# EAGLE design thermocoupleMv1 (EAGLE 6.2)
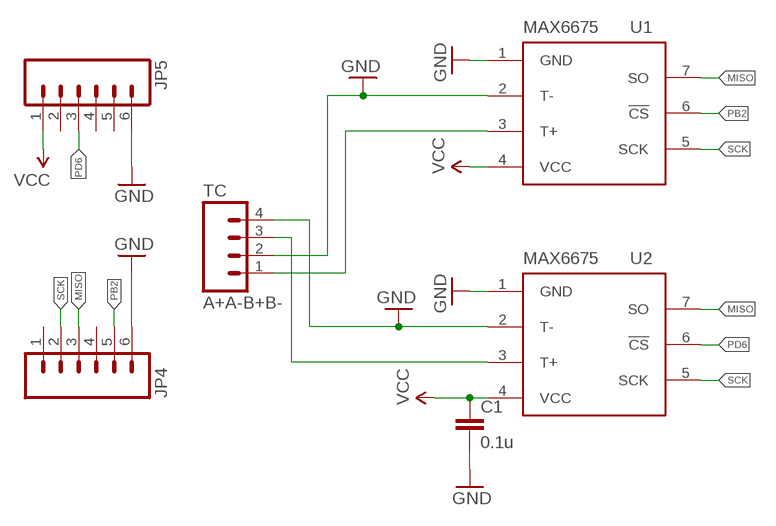
[diagram p0: schematic, sheet 1]

## Parts
C1  0.1u  CAP0805  [0805]
JP4  M06LOCK_LONGPADS  [1X06_LOCK_LONGPADS]
JP5  M06LOCK_LONGPADS  [1X06_LOCK_LONGPADS]
TC  A+A-B+B-  M04LOCK_LONGPADS  [1X04_LOCK_LONGPADS]
U1  MAX6675  [SO08]
U2  MAX6675  [SO08]

## Nets
GND: C1.2 JP4.6 JP5.6 TC.2 TC.4 U1.1(GND) U1.2(T-) U2.1(GND) U2.2(T-)
MISO: JP4.3 U1.7(SO) U2.7(SO)
N$1: TC.1 U1.3(T+)
N$3: TC.3 U2.3(T+)
PB2: JP4.5 U1.6(!CS)
PD6: JP5.3 U2.6(!CS)
SCK: JP4.2 U1.5(SCK) U2.5(SCK)
VCC: C1.1 JP5.1 U1.4(VCC) U2.4(VCC)
Unconnected: JP4.1 JP4.4 JP5.2 JP5.4 JP5.5

## Library data of the parts
C1 = SparkFun-Capacitors:CAP: Capacitor Standard 0603 ceramic capacitor, and 0.1" leaded capacitor.
JP4 JP5 = SparkFun:M06: Header 6 Standard 6-pin 0.1" header. Use with straight break away headers (SKU : PRT-00116), right angle break away headers (PRT-00553), swiss pins (PRT-00743), machine pins (PRT-00117), and female headers (PRT-00115). Molex polarized connector foot print use with SKU : PRT-08094 with associated crimp pins and housings. NOTES ON THE VARIANTS LOCK and LOCK_LONGPADS... This footprint was designed to help hold the alignment of a through-hole component (i.e. 6-pin header) while soldering it into place. You may notice that each hole has been shifted either up or down by 0.005 of an inch from it's more standard position (which is a perfectly straight line). This slight alteration caused the pins (the squares in the middle) to touch the edges of the holes. Because they are alternating, it causes a "brace" to hold the component in place. 0.005 has proven to be the perfect amount of "off-center" position when using our standard breakaway headers. Although looks a little odd when you look at the bare footprint, once you have a header in there, the alteration is very hard to notice. Also, if you push a header all the way into place, it is covered up entirely on the bottom side. This idea of altering the position of holes to aid alignment will be further integrated into the Sparkfun Library for other footprints. It can help hold any component with 3 or more connection pins.
TC = SparkFun:M04: Header 4 Standard 4-pin 0.1" header. Use with straight break away headers (SKU : PRT-00116), right angle break away headers (PRT-00553), swiss pins (PRT-00743), machine pins (PRT-00117), and female headers (PRT-00115). Molex polarized connector foot print use with SKU : PRT-08231 with associated crimp pins and housings.
U1 U2 = exoteric-analytics-custom:MAX6675

## Board
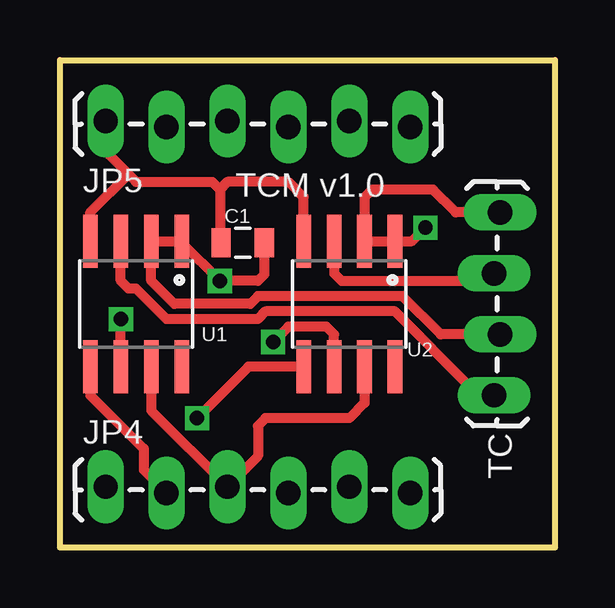
[diagram p1: board, top side]
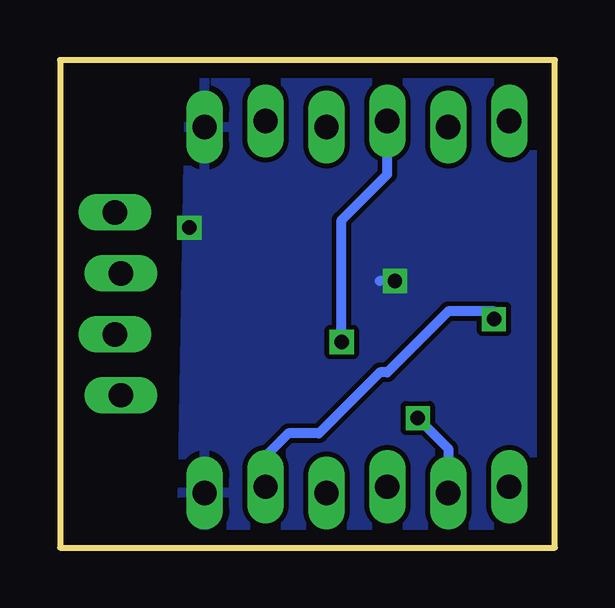
[diagram p2: board, bottom side, seen from below]

Size 20.64 x 20.32 mm. Coordinates in mm from the lower left corner, seen from the top.
Outline: 0,0 0,20.32 20.64,20.32 20.64,0 0,0
Copper layers (1*16): Top 0.035mm / dielectric 1.5mm / Bottom 0.035mm
Design rules: minimum track width 10mil, minimum drill 20mil, track to track 8mil, track to pad 8mil, pad to pad 8mil, via to via 8mil, smd to smd 8mil, copper to edge 24mil, drill to drill 8mil, minimum pad ring 10mil, minimum via ring 8mil, stop-mask expansion 4mil, vias tented up to drill 0mil, thermal gap 10mil

### Footprints (pad centres in the part's own frame; a part is rotated, then mirrored left to right if it is on the bottom)
0805 = smd 0.8 x 1.2: 1 -0.9,0; 2 0.9,0
1X06_LOCK_LONGPADS = drill 1.016 long: 1 0,0; 2 2.54,-0.254; 3 5.08,0; 4 7.62,-0.254; 5 10.16,0; 6 12.7,-0.254
1X04_LOCK_LONGPADS = drill 1.016 long: 1 0,0; 2 2.54,-0.254; 3 5.08,0; 4 7.62,-0.254
SO08 = smd 0.61 x 2.21: 1 -1.905,-2.616; 2 -0.635,-2.616; 3 0.635,-2.616; 4 1.905,-2.616; 5 1.905,2.616; 6 0.635,2.616; 7 -0.635,2.616; 8 -1.905,2.616

### Placement (x,y rotation side)
C1  7.62,12.7 0 top
JP4  1.91,2.54 0 top
JP5  1.91,17.78 0 top
TC  18.1,6.35 90 top
U1  3.17,10.16 180 top
U2  12.06,10.16 180 top

### Tracks (layer width: path | path; a pad name or v marks a point on that pad's centre or on a via)
GND  (via drill 0.6)
  Top 0.406: v15.24,13.34 14.68,12.78 U2.1 U2.2 12.7,14.61 13.02,14.92 15.56,14.92 16.51,13.97 TC.4 | TC.2 15.88,8.89 14.29,10.48 8.26,10.48 7.94,10.16 4.76,10.16 3.81,11.11 U1.2 U1.1 5.08,12.7 v6.67,11.11 8.26,11.11 8.52,11.38 C1.2
  Bottom 0.406: v15.24,13.34 14.92,13.34 | v6.67,11.11 7.3,11.11
  pour Bottom: 0.64,19.68 15.24,19.68 15.56,0.64 0.64,0.64
MISO
  Top 0.406: U1.7 3.81,5.71 JP4.3 8.26,3.81 8.26,5.08 8.57,5.4 12.06,5.4 12.7,6.03 U2.7
N$1
  Top 0.406: TC.1 17.14,6.67 13.97,9.84 8.57,9.84 8.26,9.53 4.45,9.53 3.17,10.79 2.86,10.79 2.54,11.11 U1.3
N$3
  Top 0.406: U2.3 11.43,11.43 11.75,11.11 16.83,11.11 TC.3
PB2  (via drill 0.6)
  Top 0.406: U1.6 v2.54,9.53
  Bottom 0.406: v2.54,9.53 2.54,9.84 4.45,9.84 6.99,7.3 7.3,7.3 9.84,4.76 11.11,4.76 12.06,3.81 JP4.5
PD6  (via drill 0.6)
  Top 0.406: U2.6 11.43,8.89 11.11,9.21 9.53,9.21 v8.89,8.57
  Bottom 0.406: v8.89,8.57 8.89,13.65 6.99,15.56 JP5.3
SCK  (via drill 0.6)
  Top 0.406: U1.5 1.27,6.35 3.49,4.13 3.49,3.24 JP4.2 | U2.5 7.86,7.54 v5.71,5.4
  Bottom 0.406: v5.71,5.4 4.45,4.13 JP4.2
VCC
  Top 0.406: JP5.1 1.91,16.51 2.86,15.56 | 2.86,15.56 3.17,15.24 6.35,15.24 6.67,14.92 | 6.67,14.92 6.67,12.75 C1.1 | U1.4 1.27,13.97 2.86,15.56 | U2.4 10.16,14.61 9.53,15.24 6.99,15.24 6.67,14.92

### Text on the board
tPlace: TCM v1.0